# EAGLE design Wordclock-main-xtended (EAGLE 6.3)
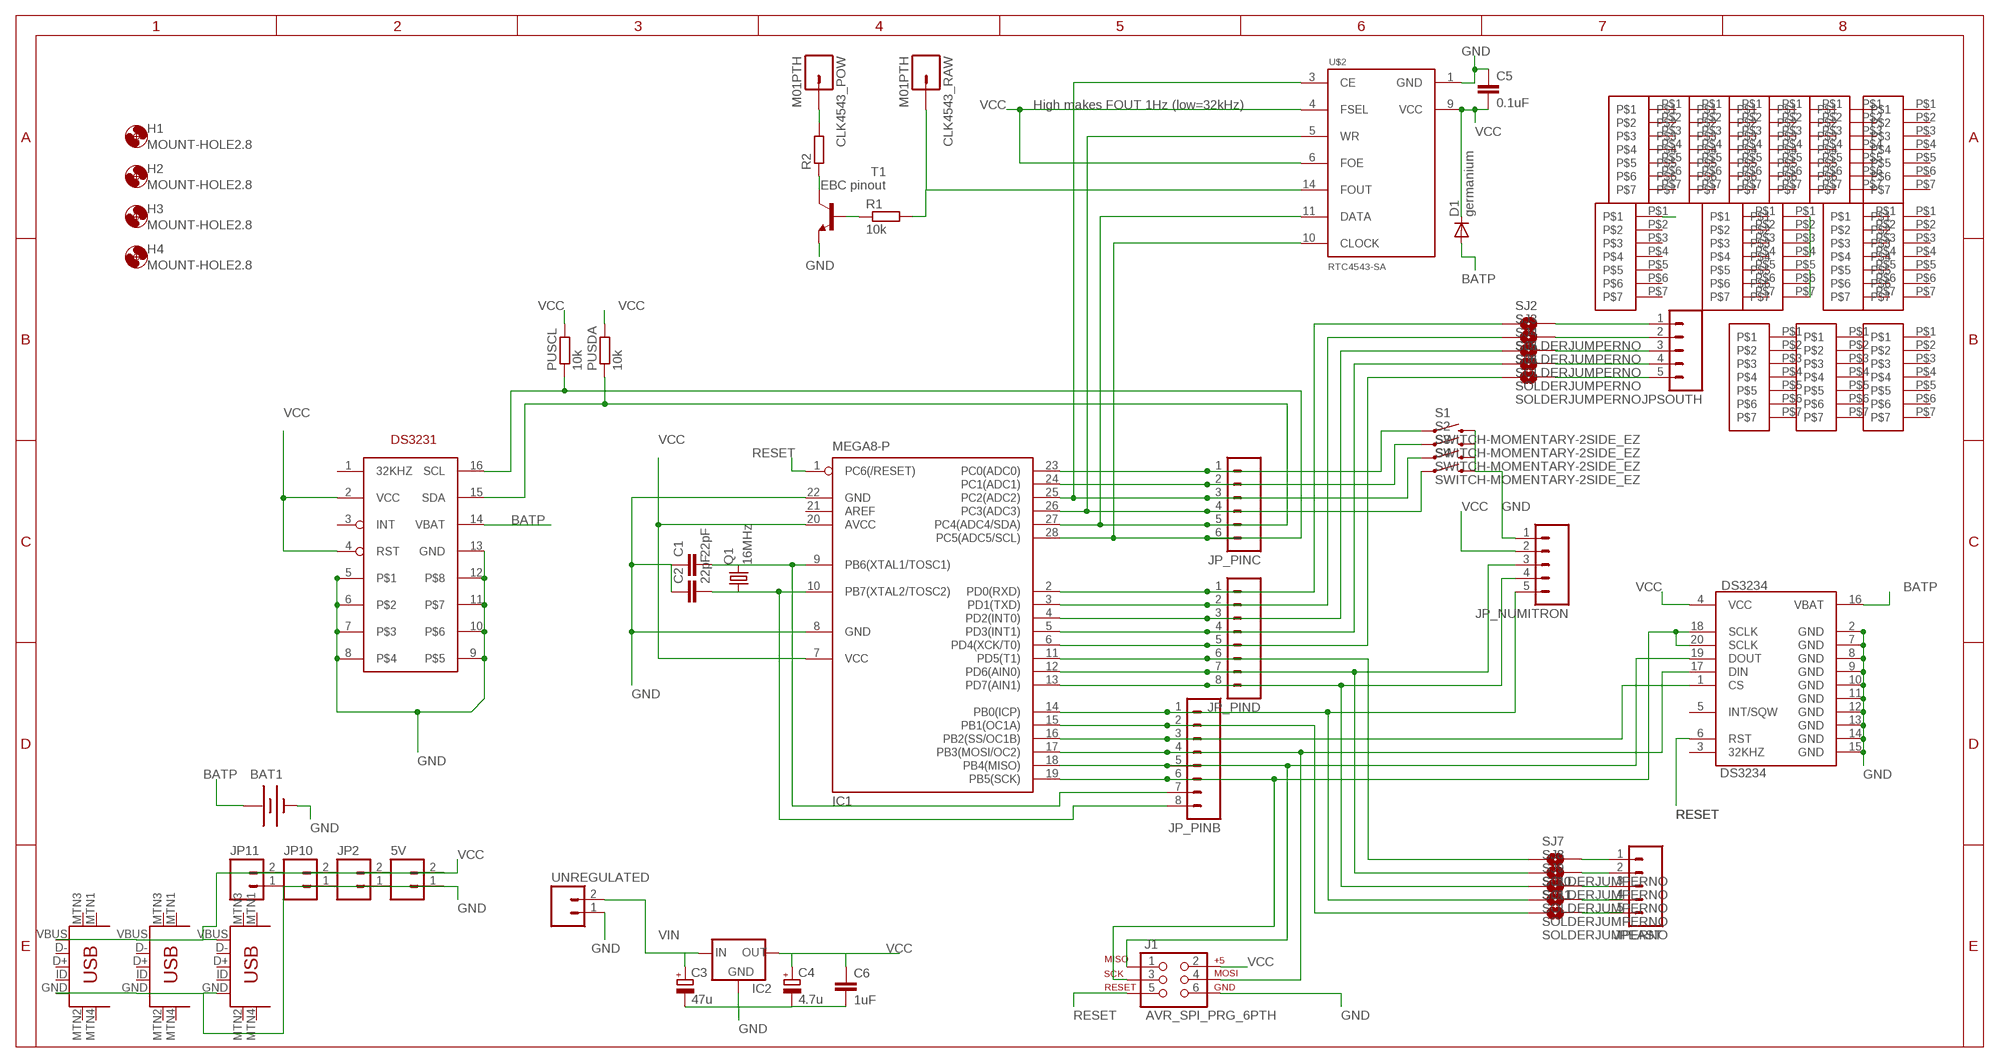
[diagram p0: schematic, sheet 1]

## Parts
5V  M02PTH  [1X02]
BAT1  BATTERY20PTH  [BATTCOM_20MM_PTH]
C1  22pF  C-EU025-024X044  [C025-024X044]
C2  22pF  C-EU025-024X044  [C025-024X044]
C3  47u  CPOL-EUE2,5-6E  [E2,5-6E]
C4  4.7u  CPOL-EUE2,5-6E  [E2,5-6E]
C5  0.1uF  C-EU025-024X044  [C025-024X044]
C6  1uF  C-EU025-024X044  [C025-024X044]
CLK4543_POW  M01PTH  [1X01]
CLK4543_RAW  M01PTH  [1X01]
D1  germanium  DIODE-D-7.5  [D-7.5]
DS3234  DS3234  [DS3234]
H1  MOUNT-HOLE2.8  [2,8]
H2  MOUNT-HOLE2.8  [2,8]
H3  MOUNT-HOLE2.8  [2,8]
H4  MOUNT-HOLE2.8  [2,8]
IC1  MEGA8-P  [DIL28-3]
IC2  V_REG_78XXSIDE  [78XXL]
J1  AVR_SPI_PRG_6PTH  [2X3]
JP1  M7_NOSILK  [M7_NOSILK]
JP2  M02PTH  [1X02]
JP3  M7_NOSILK  [M7_NOSILK]
JP4  M7_NOSILK  [M7_NOSILK]
JP5  M7_NOSILK  [M7_NOSILK]
JP6  M7_NOSILK  [M7_NOSILK]
JP7  M7_NOSILK  [M7_NOSILK]
JP8  M7_NOSILK  [M7_NOSILK]
JP9  M7_NOSILK  [M7_NOSILK]
JP10  M02PTH3  [1X02_LONGPADS]
JP11  M02PTH3  [1X02_LONGPADS]
JP_NUMITRON  M05PTH  [1X05]
JP_PINB  M081X08  [1X08]
JP_PINC  M06SIP  [1X06]
JP_PIND  M081X08  [1X08]
JPEAST  M05PTH  [1X05]
JPSOUTH  M05PTH  [1X05]
PUSCL  10k  R-EU_0204/5  [0204/5]
PUSDA  10k  R-EU_0204/5  [0204/5]
Q1  16MHz  CRYSTALHC49S  [HC49/S]
R1  10k  R-EU_0204/5  [0204/5]
R2  R-EU_0204/5  [0204/5]
S1  SWITCH-MOMENTARY-2SIDE_EZ  [TACTILE-PTH-SIDEEZ]
S2  SWITCH-MOMENTARY-2SIDE_EZ  [TACTILE-PTH-SIDEEZ]
S3  SWITCH-MOMENTARY-2SIDE_EZ  [TACTILE-PTH-SIDEEZ]
S4  SWITCH-MOMENTARY-2SIDE_EZ  [TACTILE-PTH-SIDEEZ]
SJ2  SOLDERJUMPERNO  [SJ_2S-NO]
SJ3  SOLDERJUMPERNO  [SJ_2S-NO]
SJ4  SOLDERJUMPERNO  [SJ_2S-NO]
SJ5  SOLDERJUMPERNO  [SJ_2S-NO]
SJ6  SOLDERJUMPERNO  [SJ_2S-NO]
SJ7  SOLDERJUMPERNO  [SJ_2S-NO]
SJ8  SOLDERJUMPERNO  [SJ_2S-NO]
SJ9  SOLDERJUMPERNO  [SJ_2S-NO]
SJ10  SOLDERJUMPERNO  [SJ_2S-NO]
SJ11  SOLDERJUMPERNO  [SJ_2S-NO]
T1  EBC pinout  -NPN-TO92-EBC  [TO92-EBC]
U$1  DS3231DS3231-SO16W  [SO16W]
U$2  RTC4543-SA  [SOP14]
U$3  M7_NOSILK  [M7_NOSILK]
U$4  M7_NOSILK  [M7_NOSILK]
U$5  M7_NOSILK  [M7_NOSILK]
U$6  M7_NOSILK  [M7_NOSILK]
U$7  USB-MINIB-5PIN  [USB-MINIB]
U$8  M7_NOSILK  [M7_NOSILK]
U$9  M7_NOSILK  [M7_NOSILK]
U$10  M7_NOSILK  [M7_NOSILK]
U$11  USB-MINIB-5PIN  [USB-MINIB]
U$12  USB-MINIB-5PIN  [USB-MINIB]
UNREGULATED  M02PTH3  [1X02_LONGPADS]

## Nets
BATP: BAT1.1(+) D1.A DS3234.16(VBAT) U$1.14(VBAT)
GND: 5V.1 BAT1.2(-) C1.1 C2.1 C3.- C4.- C5.1 C6.2 DS3234.2(GND) DS3234.7(GND) DS3234.8(GND) DS3234.9(GND) DS3234.10(GND) DS3234.11(GND) DS3234.12(GND) DS3234.13(GND) DS3234.14(GND) DS3234.15(GND) IC1.8(GND) IC1.22(GND) IC2.GND J1.6 JP2.1 JP10.1 JP11.1 JP_NUMITRON.1 S1.2 S2.2 S3.2 S4.2 T1.E U$1.5 U$1.6 U$1.7 U$1.8 U$1.9 U$1.10 U$1.11 U$1.12 U$1.13(GND) U$2.1(GND) U$7.GND U$8.P$1 U$8.P$2 U$8.P$3 U$8.P$4 U$11.GND U$12.GND UNREGULATED.1
N$1: IC1.23(PC0(ADC0)) JP_PINC.1 S1.1
N$2: IC1.24(PC1(ADC1)) JP_PINC.2 S2.1
N$3: JPEAST.1 SJ7.2
N$4: C1.2 IC1.9(PB6(XTAL1/TOSC1)) JP_PINB.7 Q1.2
N$5: C2.2 IC1.10(PB7(XTAL2/TOSC2)) JP_PINB.8 Q1.1
N$6: DS3234.1(CS) IC1.16(PB2(SS/OC1B)) JP_PINB.3
N$7: IC1.25(PC2(ADC2)) JP_PINC.3 S3.1 U$2.3(CE)
N$8: JPEAST.2 SJ8.2
N$9: JPEAST.3 SJ9.2
N$10: JPEAST.4 SJ10.2
N$11: JPEAST.5 SJ11.2
N$12: DS3234.18(SCLK) DS3234.20(SCLK) IC1.19(PB5(SCK)) J1.3 JP_PINB.6
N$13: DS3234.19(DOUT) IC1.18(PB4(MISO)) J1.1 JP_PINB.5
N$14: DS3234.17(DIN) IC1.17(PB3(MOSI/OC2)) J1.4 JP_PINB.4
N$15: JPSOUTH.1 SJ2.2
N$16: JPSOUTH.2 SJ3.2
N$17: JPSOUTH.3 SJ4.2
N$18: JPSOUTH.4 SJ5.2
N$19: JPSOUTH.5 SJ6.2
N$20: IC1.2(PD0(RXD)) JP_PIND.1 SJ2.1
N$21: IC1.3(PD1(TXD)) JP_PIND.2 SJ3.1
N$22: IC1.4(PD2(INT0)) JP_PIND.3 SJ4.1
N$23: IC1.5(PD3(INT1)) JP_PIND.4 SJ5.1
N$24: IC1.6(PD4(XCK/T0)) JP_PIND.5 SJ6.1
N$25: IC1.15(PB1(OC1A)) JP_PINB.2 SJ11.1
N$26: IC1.14(PB0(ICP)) JP_NUMITRON.5 JP_PINB.1 SJ10.1
N$27: IC1.13(PD7(AIN1)) JP_NUMITRON.4 JP_PIND.8 SJ9.1
N$28: IC1.12(PD6(AIN0)) JP_NUMITRON.3 JP_PIND.7 SJ8.1
N$29: IC1.11(PD5(T1)) JP_PIND.6 SJ7.1
N$30: IC1.28(PC5(ADC5/SCL)) JP_PINC.6 PUSCL.1 U$1.16(SCL) U$2.10(CLOCK)
N$31: IC1.27(PC4(ADC4/SDA)) JP_PINC.5 PUSDA.1 U$1.15(SDA) U$2.11(DATA)
N$32: IC1.26(PC3(ADC3)) JP_PINC.4 S4.1 U$2.5(WR)
N$33: CLK4543_RAW.1 R1.2 U$2.14(FOUT)
N$34: R1.1 T1.B
N$35: R2.1 T1.C
N$36: CLK4543_POW.1 R2.2
RESET: DS3234.6(RST) IC1.1(PC6(/RESET)) J1.5
VCC: 5V.2 C4.+ C5.2 C6.1 D1.C DS3234.4(VCC) IC1.7(VCC) IC1.20(AVCC) IC2.OUT J1.2 JP2.2 JP10.2 JP11.2 JP_NUMITRON.2 PUSCL.2 PUSDA.2 U$1.2(VCC) U$1.4(RST) U$2.4(FSEL) U$2.6(FOE) U$2.9(VCC) U$7.VBUS U$8.P$5 U$8.P$6 U$8.P$7 U$10.P$1 U$11.VBUS U$12.VBUS
VIN: C3.+ IC2.IN UNREGULATED.2
Unconnected: DS3234.3(32KHZ) DS3234.5(INT/SQW) IC1.21(AREF) JP1.P$1 JP1.P$2 JP1.P$3 JP1.P$4 JP1.P$5 JP1.P$6 JP1.P$7 JP3.P$1 JP3.P$2 JP3.P$3 JP3.P$4 JP3.P$5 JP3.P$6 JP3.P$7 JP4.P$1 JP4.P$2 JP4.P$3 JP4.P$4 JP4.P$5 JP4.P$6 JP4.P$7 JP5.P$1 JP5.P$2 JP5.P$3 JP5.P$4 JP5.P$5 JP5.P$6 JP5.P$7 JP6.P$1 JP6.P$2 JP6.P$3 JP6.P$4 JP6.P$5 JP6.P$6 JP6.P$7 JP7.P$1 JP7.P$2 JP7.P$3 JP7.P$4 JP7.P$5 JP7.P$6 JP7.P$7 JP8.P$1 JP8.P$2 JP8.P$3 JP8.P$4 JP8.P$5 JP8.P$6 JP8.P$7 JP9.P$1 JP9.P$2 JP9.P$3 JP9.P$4 JP9.P$5 JP9.P$6 JP9.P$7 U$1.1(32KHZ) U$1.3(INT) U$3.P$1 U$3.P$2 U$3.P$3 U$3.P$4 U$3.P$5 U$3.P$6 U$3.P$7 U$4.P$1 U$4.P$2 U$4.P$3 U$4.P$4 U$4.P$5 U$4.P$6 U$4.P$7 U$5.P$1 U$5.P$2 U$5.P$3 U$5.P$4 U$5.P$5 U$5.P$6 U$5.P$7 U$6.P$1 U$6.P$2 U$6.P$3 U$6.P$4 U$6.P$5 U$6.P$6 U$6.P$7 U$7.D+ U$7.D- U$7.ID U$7.MTN1(MTN2) U$7.MTN2(MTN3) U$7.MTN3(MTN1) U$7.MTN4 U$9.P$1 U$9.P$2 U$9.P$3 U$9.P$4 U$9.P$5 U$9.P$6 U$9.P$7 U$10.P$2 U$10.P$3 U$10.P$4 U$10.P$5 U$10.P$6 U$10.P$7 U$11.D+ U$11.D- U$11.ID U$11.MTN1(MTN2) U$11.MTN2(MTN3) U$11.MTN3(MTN1) U$11.MTN4 U$12.D+ U$12.D- U$12.ID U$12.MTN1(MTN2) U$12.MTN2(MTN3) U$12.MTN3(MTN1) U$12.MTN4

## Notes on the sheet
- High makes FOUT 1Hz (low=32kHz)

## Library data of the parts
5V JP2 JP10 JP11 = SparkFun-Connectors:M02: Header 2 Standard 2-pin 0.1" header. Use with straight break away headers (SKU : PRT-00116), right angle break away headers (PRT-00553), swiss pins (PRT-00743), machine pins (PRT-00117), and female headers (PRT-00115). Molex polarized connector foot print use with SKU : PRT-08233 with associated crimp pins and housings.
BAT1 = SparkFun:BATTERY: Battery Holders Various common sizes : AA, AAA, 20mm coin cell and 12mm coin cell.
C1 C2 C5 C6 = resistor:C-EU: CAPACITOR, European symbol
C3 C4 = resistor:CPOL-EU: POLARIZED CAPACITOR, European symbol
CLK4543_POW CLK4543_RAW = SparkFun-Connectors:M01: Header 1 Standard 1-pin 0.1" header. Use with straight break away headers (SKU : PRT-00116), right angle break away headers (PRT-00553), swiss pins (PRT-00743), machine pins (PRT-00117), and female headers (PRT-00115).
D1 = diode:DIODE-: DIODE
DS3234 = SparkFun:DS3234: DS3234 Real Time Clock
H1-H4 = holes:MOUNT-HOLE: MOUNTING HOLE with drill center marker
IC1 = atmel:MEGA8-P: MICROCONTROLLER 8 Kbytes FLASH, 1 kbytes SRAM, 512 bytes EEPROM, USART, 4-channel 10 bit ADC, 2-channel 8 bit ADC Pin compatible with Atmega48, ATMega88, ATMega168 Source: avr.lbr; OC_FARNELL: unknown; OC_NEWARK: unknown
IC2 = SparkFun:V_REG_78XX: Voltage Regulator Standard 7805 5V regulator. IGO (Input Ground Output). Spark Fun Electronics SKU : COM-00107
J1 = SparkFun:AVR_SPI_PRG_6: AVR ISP 6 Pin This is the reduced ISP connector for AVR programming. Common on Arduino. This footprint will take up less PCB space and can be used with a 10-pin to 6-pin adapter such as SKU: BOB-08508
JP1 JP3-JP9 U$3-U$6 U$8-U$10 = kalshagar:M7_NOSILK
JP_NUMITRON = SparkFun-Connectors:M05: Header 5 Standard 5-pin 0.1" header. Use with straight break away headers (SKU : PRT-00116), right angle break away headers (PRT-00553), swiss pins (PRT-00743), machine pins (PRT-00117), and female headers (PRT-00115). Molex polarized connector foot print use with SKU : PRT-08230 with associated crimp pins and housings.
JP_PINB JP_PIND = SparkFun-Connectors:M08: Header 8 Standard 8-pin 0.1" header. Use with straight break away headers (SKU : PRT-00116), right angle break away headers (PRT-00553), swiss pins (PRT-00743), machine pins (PRT-00117), and female headers (PRT-00115).
JP_PINC = SparkFun-Connectors:M06: Header 6 Standard 6-pin 0.1" header. Use with straight break away headers (SKU : PRT-00116), right angle break away headers (PRT-00553), swiss pins (PRT-00743), machine pins (PRT-00117), and female headers (PRT-00115). Molex polarized connector foot print use with SKU : PRT-08094 with associated crimp pins and housings. NOTES ON THE VARIANTS LOCK and LOCK_LONGPADS... This footprint was designed to help hold the alignment of a through-hole component (i.e. 6-pin header) while soldering it into place. You may notice that each hole has been shifted either up or down by 0.005 of an inch from it's more standard position (which is a perfectly straight line). This slight alteration caused the pins (the squares in the middle) to touch the edges of the holes. Because they are alternating, it causes a "brace" to hold the component in place. 0.005 has proven to be the perfect amount of "off-center" position when using our standard breakaway headers. Although looks a little odd when you look at the bare footprint, once you have a header in there, the alteration is very hard to notice. Also, if you push a header all the way into place, it is covered up entirely on the bottom side. This idea of altering the position of holes to aid alignment will be further integrated into the Sparkfun Library for other footprints. It can help hold any component with 3 or more connection pins.
JPEAST JPSOUTH = SparkFun:M05: Header 5 Standard 5-pin 0.1" header. Use with straight break away headers (SKU : PRT-00116), right angle break away headers (PRT-00553), swiss pins (PRT-00743), machine pins (PRT-00117), and female headers (PRT-00115). Molex polarized connector foot print use with SKU : PRT-08230 with associated crimp pins and housings.
PUSCL PUSDA R1 R2 = resistor:R-EU_: RESISTOR, European symbol
Q1 = crystal:CRYSTAL: CRYSTAL; OC_FARNELL: 1667008; OC_NEWARK: unknown
S1-S4 = SparkFun-Electromechanical:SWITCH-MOMENTARY-2: Various NO switches- pushbuttons, reed, etc
SJ2-SJ11 = SparkFun:SOLDERJUMPER: Solder Jumper Standard SMD solder jumper. Used to automate production. Two varients : Normally Open and Normally Closed are the same, but have different paste layers. NC will have a large amount of paste and should jumper during reflow.
T1 = transistor:*-NPN-: NPN Transistror BF959 corrected 2008.03.06
U$1 = kalshagar:DS3231: DS3231 with a WIDE package SO16W. About 1cm x 1cm.
U$2 = kalshagar:RTC4543-SA
U$7 U$11 U$12 = SparkFun-Connectors:USB-MINIB: Mini-USB "B" connector with 5th pin broken out. Created new symbol breaking out 5th "ID" pin in mini/micro USB connector spec. See: http://en.wikipedia.org/wiki/Mini_usb#Cables. Uses same footprint as 4-pin symbol. Also added pins to connect to mounting / shield pads if required (probably not generally needed as signals aren't shielded once they leave the connector).
UNREGULATED = SparkFun:M02: Header 2 Standard 2-pin 0.1" header. Use with straight break away headers (SKU : PRT-00116), right angle break away headers (PRT-00553), swiss pins (PRT-00743), machine pins (PRT-00117), and female headers (PRT-00115). Molex polarized connector foot print use with SKU : PRT-08233 with associated crimp pins and housings.

## Board
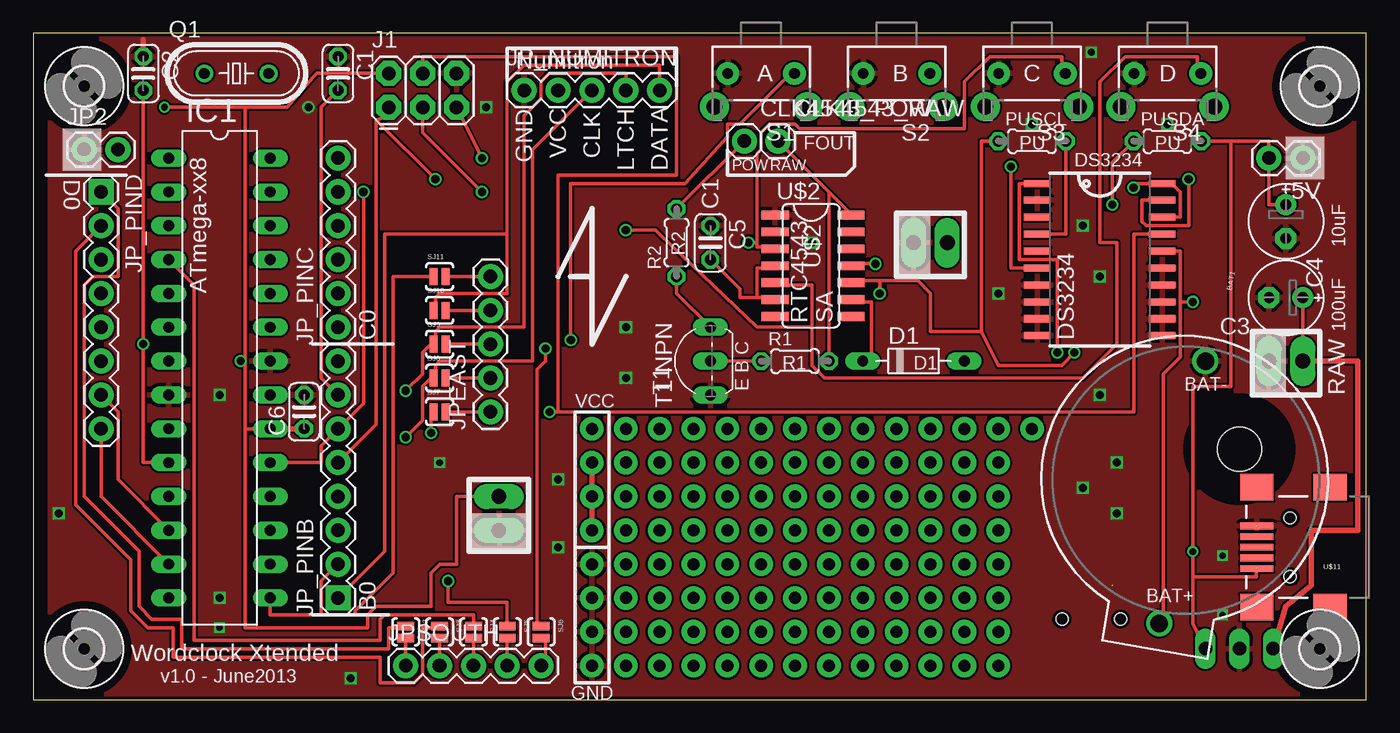
[diagram p1: board, top side]
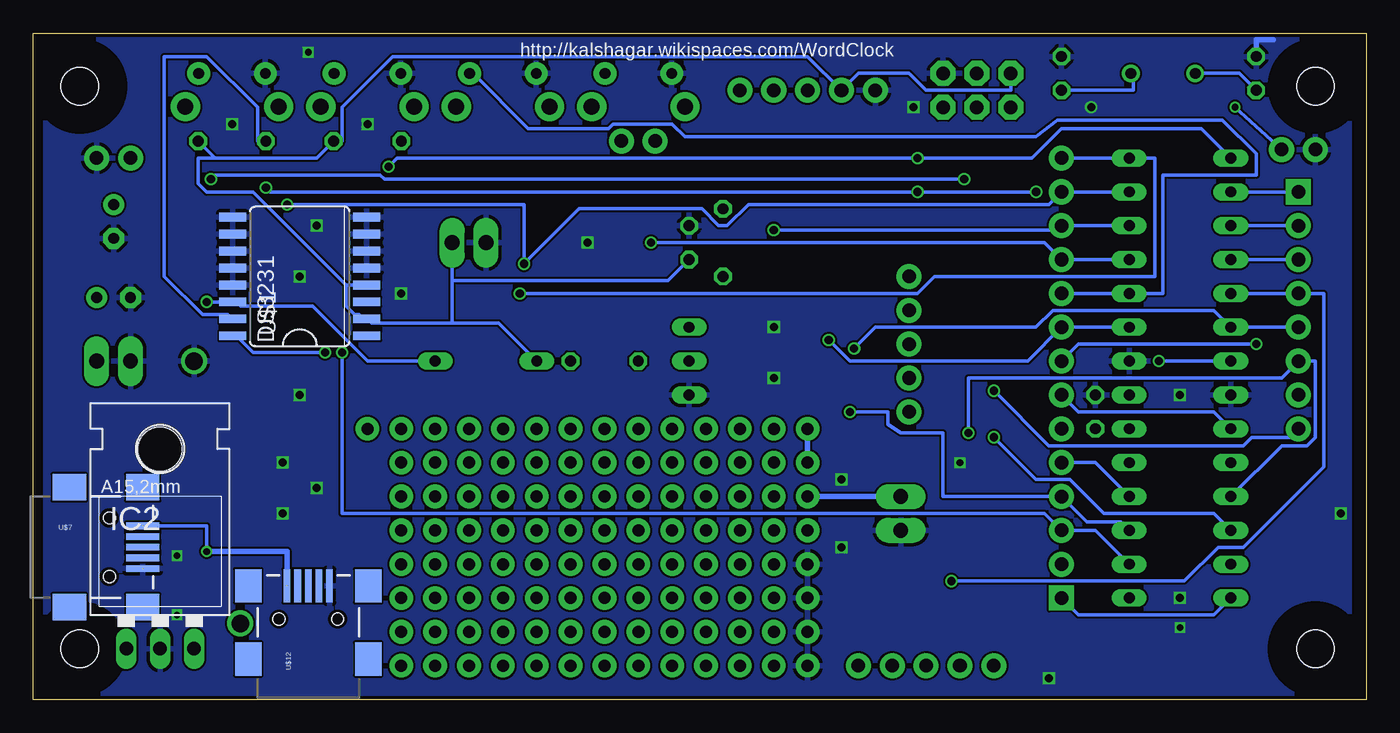
[diagram p2: board, bottom side, seen from below]

Size 100 x 50 mm. Coordinates in mm from the lower left corner, seen from the top.
Outline: 0,0 100,0 100,50 0,50 0,0
Copper layers (1*16): Top 0.035mm / dielectric 1.5mm / Bottom 0.035mm
Design rules "Fusion_eagle_rule_v1.1": minimum track width 6mil, minimum drill 12mil, track to track 6mil, track to pad 6mil, pad to pad 6mil, via to via 6mil, smd to smd 0mil, copper to edge 10mil, drill to drill 10mil, minimum pad ring 10mil, minimum via ring 6mil, stop-mask expansion 2mil, vias tented up to drill 100mil, thermal gap 10mil
tKeepout: area 0,0 to 2.5,50; area 97.5,0 to 100,50

### Footprints (pad centres in the part's own frame; a part is rotated, then mirrored left to right if it is on the bottom)
1X02 = drill 1.016 pad 1.88: 1 0,0; 2 2.54,0
BATTCOM_20MM_PTH = drill 1.3: 1 20,0; 2 0,0
C025-024X044 = drill 0.813 octagon: 1 -1.27,0; 2 1.27,0
E2,5-6E = drill 0.813 pad 1.575: + -1.27,0 | drill 0.813 pad 1.575 octagon: - 1.27,0
1X01 = drill 1.016 pad 1.88: 1 0,0
D-7.5 = drill 0.813 long: A 3.81,0; C -3.81,0
DS3234 = smd 0.53 x 1.98: 1 -5.715,-4.685; 2 -4.445,-4.685; 3 -3.175,-4.685; 4 -1.905,-4.685; 5 -0.635,-4.685; 6 0.635,-4.685; 7 1.905,-4.685; 8 3.175,-4.685; 9 4.445,-4.685; 10 5.715,-4.685; 11 5.715,4.685; 12 4.445,4.685; 13 3.175,4.685; 14 1.905,4.685; 15 0.635,4.685; 16 -0.635,4.685; 17 -1.905,4.685; 18 -3.175,4.685; 19 -4.445,4.685; 20 -5.715,4.685
2,8 = hole 2.8: 0,0
DIL28-3 = drill 0.813 long: 1 -16.51,-3.81; 2 -13.97,-3.81; 3 -11.43,-3.81; 4 -8.89,-3.81; 5 -6.35,-3.81; 6 -3.81,-3.81; 7 -1.27,-3.81; 8 1.27,-3.81; 9 3.81,-3.81; 10 6.35,-3.81; 11 8.89,-3.81; 12 11.43,-3.81; 13 13.97,-3.81; 14 16.51,-3.81; 15 16.51,3.81; 16 13.97,3.81; 17 11.43,3.81; 18 8.89,3.81; 19 6.35,3.81; 20 3.81,3.81; 21 1.27,3.81; 22 -1.27,3.81; 23 -3.81,3.81; 24 -6.35,3.81; 25 -8.89,3.81; 26 -11.43,3.81; 27 -13.97,3.81; 28 -16.51,3.81
78XXL = drill 1.016 long: GND 0,-3.81; IN -2.54,-3.81; OUT 2.54,-3.81 | hole 3.302: 0,11.176
2X3 = drill 1.016 pad 1.88 octagon: 1 0,0; 2 0,2.54; 3 2.54,0; 4 2.54,2.54; 5 5.08,0; 6 5.08,2.54
M7_NOSILK = drill 0.9 pad 1.778: P$1 0,0; P$2 2.54,0; P$3 5.08,0; P$4 7.62,0; P$5 10.16,0; P$6 12.7,0; P$7 15.24,0
1X02_LONGPADS = drill 1.118 pad 1.88 long: 1 0,0; 2 2.54,0
1X05 = drill 1.016 pad 1.88: 1 0,0; 2 2.54,0; 3 5.08,0; 4 7.62,0; 5 10.16,0
1X08 = drill 1.016 pad 1.88 square: 1 0,0 | drill 1.016 pad 1.88: 2 2.54,0; 3 5.08,0; 4 7.62,0; 5 10.16,0; 6 12.7,0; 7 15.24,0; 8 17.78,0
1X06 = drill 1.016 pad 1.88: 1 0,0; 2 2.54,0; 3 5.08,0; 4 7.62,0; 5 10.16,0; 6 12.7,0
0204/5 = drill 0.813 octagon: 1 -2.54,0; 2 2.54,0
HC49/S = drill 0.813: 1 -2.413,0; 2 2.413,0
TACTILE-PTH-SIDEEZ = drill 0.8 pad 1.7: 1 -2.5,0; 2 2.5,0 | drill 1.2 pad 2.2: ANCHOR1 -3.5,2.5; ANCHOR2 3.5,2.5
SJ_2S-NO = smd 0.635 x 1.27: 1 -0.45,0; 2 0.45,0
TO92-EBC = drill 0.813 long: B 0,-1.27; C 2.54,-1.27; E -2.54,-1.27
SO16W = smd 0.66 x 2.032: 1 -5.715,-5.029; 2 -4.445,-5.029; 3 -3.175,-5.029; 4 -1.905,-5.029; 5 -0.635,-5.029; 6 0.635,-5.029; 7 1.905,-5.029; 8 3.175,-5.029; 9 3.175,5.029; 10 1.905,5.029; 11 0.635,5.029; 12 -0.635,5.029; 13 -1.905,5.029; 14 -3.175,5.029; 15 -4.445,5.029; 16 -5.715,5.029
SOP14 = smd 0.66 x 2.032: 1 -3.345,-2.76; 2 -2.075,-2.76; 3 -0.805,-2.76; 4 0.465,-2.76; 5 1.735,-2.76; 6 3.005,-2.76; 7 4.275,-2.76; 8 4.275,2.917; 9 3.005,2.917; 10 1.735,2.917; 11 0.465,2.917; 12 -0.805,2.917; 13 -2.075,2.917; 14 -3.345,2.917
USB-MINIB = smd 2.5 x 0.5: D+ 2.5,0; D- 2.5,0.8; GND 2.5,-1.6; ID 2.5,-0.8; VBUS 2.5,1.6 | smd 2.5 x 2: MTN1 -3,4.5; MTN2 2.5,4.5; MTN3 -3,-4.5; MTN4 2.5,-4.5 | hole 0.9: 0,2.2; 0,-2.2

### Placement (x,y rotation side)
5V  95.25,40.64 180 top
BAT1  87.95,25.4 260 top
C1  22.86,46.99 270 top
C2  8.26,46.99 270 top
C3  93.98,30.16 180 top
C4  93.98,35.88 270 top
C5  50.8,34.29 270 top
C6  20.32,21.59 90 top
CLK4543_POW  53.34,41.91 0 top
CLK4543_RAW  55.88,41.91 0 top
D1  66.04,25.4 0 top
DS3234  80.01,33.02 270 top
H1  3.81,3.81 0 top
H2  96.52,46.04 0 top
H3  96.52,3.81 0 top
H4  3.81,46.04 0 top
IC1  13.97,24.13 270 top
IC2  90.49,7.62 0 bottom
J1  26.67,44.45 0 top
JP1  69.85,2.54 90 top
JP2  3.81,41.27 0 top
JP3  67.31,2.54 90 top
JP4  64.77,2.54 90 top
JP5  62.23,2.54 90 top
JP6  59.69,2.54 90 top
JP7  57.15,2.54 90 top
JP8  54.61,2.54 90 top
JP9  52.07,2.54 90 top
JP10  66.04,34.29 0 top
JP11  34.92,12.7 90 top
JP_NUMITRON  36.83,45.72 0 top
JP_PINB  22.86,7.62 90 top
JP_PINC  22.86,27.94 90 top
JP_PIND  5.08,38.1 270 top
JPEAST  34.29,21.59 90 top
JPSOUTH  27.94,2.54 0 top
PUSCL  74.93,41.91 0 top
PUSDA  85.09,41.91 0 top
Q1  15.24,46.99 0 top
R1  57.15,25.4 0 top
R2  48.26,34.29 90 top
S1  54.61,46.99 180 top
S2  64.77,46.99 180 top
S3  74.93,46.99 180 top
S4  85.09,46.99 180 top
SJ2  27.94,5.08 270 top
SJ3  30.48,5.08 270 top
SJ4  33.02,5.08 270 top
SJ5  35.56,5.08 270 top
SJ6  38.1,5.08 270 top
SJ7  30.48,21.59 0 top
SJ8  30.48,24.13 0 top
SJ9  30.48,26.67 0 top
SJ10  30.48,29.21 0 top
SJ11  30.48,31.75 0 top
T1  49.53,25.4 90 top
U$1  80.01,33.02 90 bottom
U$2  58.42,33.02 270 top
U$3  49.53,2.54 90 top
U$4  72.39,2.54 90 top
U$5  46.99,2.54 90 top
U$6  44.45,2.54 90 top
U$7  94.3,11.43 0 bottom
U$8  41.91,2.54 90 top
U$9  59.69,20.32 0 top
U$10  41.91,20.32 0 top
U$11  94.3,11.43 180 top
U$12  79.38,6.03 90 bottom
UNREGULATED  92.71,25.4 0 top

### Tracks (layer width: path | path; a pad name or v marks a point on that pad's centre or on a via)
BATP  (via drill 0.61)
  Top 0.254: DS3234.16 86.04,33.66 86.04,29.84 | 86.04,29.84 86.04,25.72 84.77,24.45 84.77,6.03 BAT1.1 | 86.04,29.84 v87,29.84
  Bottom 0.254: D1.A 74.93,25.4 79.06,29.53 84.45,29.53 84.77,29.84 U$1.14 v87,29.84
GND  (via drill 0.5, 0.6)
  Top 0.406: C2.1 8.26,49.53
  Bottom 0.406: 6.99,49.53 8.26,49.53 C2.1
  other vias: 58.42,34.29 44.45,27.94 44.45,24.13 80.01,22.86 80.01,31.75 78.74,35.56 81.28,17.78 81.28,13.97 78.74,15.88 74.93,43.18 13.97,22.86 39.37,16.51 39.37,11.43 72.39,30.48 13.97,7.62 1.91,13.97 23.81,1.59 20.64,44.45 85.09,43.18 33.97,44.45 13.97,5.4 30.48,17.78 89.22,10.79 89.22,6.35 79.38,48.58
  pour Bottom: 1.27,52.07 99.06,52.07 99.06,-1.27 1.27,-1.27
  pour Top: 1.27,53.34 99.06,53.34 99.06,-2.54 1.27,-2.54
N$1  (via drill 0.61)
  Top 0.254: v40.32,26.99 40.32,38.73 48.9,38.73 52.07,42.23 52.07,43.18 53.02,43.18 56.83,46.99 S1.1
  Bottom 0.254: IC1.23 JP_PINC.1 25.4,25.4 38.73,25.4 v40.32,26.99
N$2
  Bottom 0.254: JP_PINC.2 IC1.24 15.24,30.48 15.24,39.37 8.26,39.37 8.26,40.96 10.79,43.5 23.18,43.5 24.77,42.23 51.12,42.23 52.07,43.18 56.52,43.18 56.83,42.86 62.87,42.86 66.99,46.99 S2.1
N$3
  Top 0.254: JPEAST.1 SJ7.2
N$4
  Top 0.254: C1.2 21.59,44.45 21.59,24.13 JP_PINB.7
  Bottom 0.254: C1.2 17.46,45.72 17.46,46.99 Q1.2 | IC1.9 11.43,21.59 21.59,21.59 JP_PINB.7
N$5  (via drill 0.61)
  Top 0.254: IC1.10 8.26,17.78 v8.26,26.67 C2.2
  Bottom 0.254: C2.2 9.53,46.99 Q1.1 | JP_PINB.8 21.59,26.67 v8.26,26.67
N$6  (via drill 0.61)
  Top 0.254: DS3234.1 73.98,38.73 73.98,33.02 76.83,33.02 v76.83,26.04
  Bottom 0.254: v76.83,26.04 76.83,13.97 24.13,13.97 JP_PINB.3 20.32,12.7 IC1.16
N$7  (via drill 0.61)
  Top 0.254: 54.29,34.29 54.29,40.96 54.61,41.27 54.61,42.55 55.24,43.18 57.15,43.18 57.47,42.86 69.85,42.86 69.85,46.35 71.75,48.26 77.15,48.26 77.15,46.99 S3.1 | 54.29,34.29 54.29,33.97 55.56,33.97 U$2.3 | 54.29,34.29 v53.66,34.29
  Bottom 0.254: IC1.25 JP_PINC.3 24.13,34.29 v53.66,34.29
N$8
  Top 0.254: JPEAST.2 SJ8.2
N$9
  Top 0.254: JPEAST.3 SJ9.2
N$10
  Top 0.254: JPEAST.4 SJ10.2
N$11
  Top 0.254: JPEAST.5 SJ11.2
N$12  (via drill 0.61)
  Top 0.254: IC1.19 21.59,17.78 21.59,19.05 JP_PINB.6 24.77,22.23 v24.77,38.1 | DS3234.18 86.04,36.2 86.04,38.1 85.41,38.73 DS3234.20 82.55,38.73 v82.55,38.42 | v33.66,38.1 29.21,42.55 J1.3
  Bottom 0.254: v82.55,38.42 82.23,38.1 v33.66,38.1 v24.77,38.1
N$13  (via drill 0.61)
  Top 0.254: DS3234.19 83.19,37.47 83.19,35.88 83.5,35.56 86.68,35.56 v86.68,39.05 | 25.72,43.5 26.67,43.81 J1.1 | 25.72,43.5 v30.16,39.05 | JP_PINB.5 25.72,20.64 25.72,43.5
  Bottom 0.254: IC1.18 20.32,17.78 JP_PINB.5 | v86.68,39.05 86.36,39.37 73.98,39.37 73.66,39.05 v30.16,39.05
N$14  (via drill 0.61)
  Top 0.254: DS3234.17 82.55,34.92 82.55,21.59 39.37,21.59 | v38.73,21.59 39.37,21.59 | J1.4 29.21,48.26 48.26,48.26 48.26,39.37 39.37,39.37 39.37,21.59
  Bottom 0.254: v38.73,21.59 35.88,21.59 35.88,20.64 34.92,20 31.75,20 31.75,15.24 JP_PINB.4 20.95,13.34 18.41,13.34 IC1.17
N$15
  Top 0.254: JPSOUTH.1 SJ2.2
N$16
  Top 0.254: JPSOUTH.2 SJ3.2
N$17
  Top 0.254: JPSOUTH.3 SJ4.2
N$18
  Top 0.254: JPSOUTH.4 SJ5.2
N$19
  Top 0.254: JPSOUTH.5 38.42,2.86 38.42,4.45 SJ6.2
N$20
  Top 0.254: JP_PIND.1 6.35,36.83 6.35,31.75 4.45,31.75 3.81,31.11 3.81,15.24 7.94,11.11 7.94,6.99 8.89,6.03 11.11,6.03 11.11,3.81 26.67,3.81 26.67,5.4 27.94,5.4 SJ2.1
  Bottom 0.254: JP_PIND.1 IC1.2
N$21
  Top 0.254: JP_PIND.2 3.17,33.66 3.17,14.61 7.3,10.48 7.3,6.67 8.57,5.4 10.48,5.4 10.48,3.17 26.04,3.17 26.04,1.27 28.57,1.27 29.21,1.91 29.21,5.4 30.48,5.4 SJ3.1
  Bottom 0.254: JP_PIND.2 IC1.3
N$22
  Top 0.254: SJ4.1 33.02,6.35 26.35,6.35 26.04,6.03 26.04,4.45 12.06,4.45 12.06,31.11 IC1.4
  Bottom 0.254: IC1.4 JP_PIND.3
N$23  (via drill 0.61)
  Top 0.254: v31.11,8.89 31.11,7.3 35.56,7.3 SJ5.1
  Bottom 0.254: v31.11,8.89 13.65,8.89 11.11,11.43 9.21,11.43 3.17,17.46 3.17,30.48 JP_PIND.4 IC1.5
N$24  (via drill 0.61)
  Top 0.254: v38.42,26.35 38.42,25.4 37.78,24.77 37.78,5.71 SJ6.1
  Bottom 0.254: v38.42,26.35 36.83,27.94 24.77,27.94 23.5,29.21 11.43,29.21 IC1.6 JP_PIND.5
N$25
  Top 0.254: SJ11.1 26.99,31.75 26.99,9.53 24.13,6.67 24.13,6.35 21.59,6.35 | 21.59,6.35 17.78,6.35 IC1.15 | JP_PINB.2 21.59,8.89 21.59,6.35
N$26
  Top 0.254: 35.56,34.92 35.56,46.35 36.83,47.62 46.99,47.62 JP_NUMITRON.5 | 35.56,34.92 35.56,30.48 30.48,30.48 30.16,30.16 30.16,29.21 SJ10.1 | JP_PINB.1 26.35,11.11 26.35,34.92 35.56,34.92
  Bottom 0.254: IC1.14 11.43,6.35 21.59,6.35 JP_PINB.1
N$27  (via drill 0.61)
  Top 0.254: IC1.13 5.08,15.24 JP_PIND.8 | JP_NUMITRON.4 44.45,46.99 38.73,46.99 38.1,46.35 38.1,45.09 36.83,43.81 36.83,27.94 30.48,27.94 30.16,27.62 30.16,26.67 SJ9.1 29.84,26.67 29.21,26.04 29.21,24.45 v27.94,23.18
  Bottom 0.254: JP_PIND.8 5.71,19.68 8.57,19.68 9.21,19.05 23.81,19.05 v27.94,23.18
N$28  (via drill 0.61)
  Top 0.254: IC1.12 6.35,16.51 6.35,21.59 JP_PIND.7 | JP_NUMITRON.3 37.47,41.27 37.47,25.4 30.48,25.4 30.16,25.08 30.16,24.13 SJ8.1 29.84,24.13 29.21,23.5 29.21,20.95 v27.94,19.68
  Bottom 0.254: IC1.12 11.43,13.97 19.68,13.97 22.23,16.51 24.77,16.51 v27.94,19.68
N$29  (via drill 0.61)
  Top 0.254: v29.84,20 29.84,21.59 SJ7.1
  Bottom 0.254: v29.84,20 29.84,24.13 6.35,24.13 JP_PIND.6 3.81,25.4 3.81,19.68 4.45,19.05 6.35,19.05 IC1.11
N$30  (via drill 0.61)
  Top 0.254: 71.12,27.62 67.31,27.62 67.31,30.48 66.36,31.43 63.5,31.43 | 63.5,31.43 61.59,31.43 U$2.10 | PUSCL.1 71.12,41.91 71.12,27.62 | v78.11,26.04 77.15,25.08 72.39,25.08 71.12,27.62 | 63.5,31.43 v63.5,30.48
  Bottom 0.254: JP_PINC.6 IC1.28 15.88,40.64 15.88,31.75 32.38,31.75 33.66,30.48 v63.5,30.48 | v78.11,26.04 83.5,26.04 84.77,27.3 U$1.16
N$31  (via drill 0.61)
  Top 0.254: v63.18,32.7 61.59,32.7 U$2.11 | PUSDA.1 80.96,40.32 v80.96,37.15
  Bottom 0.254: PUSDA.1 83.19,41.91 83.19,44.45 87,48.26 90.17,48.26 90.17,31.75 87.31,28.89 85.41,28.89 85.09,28.57 U$1.15 | IC1.27 JP_PINC.5 23.81,37.15 46.35,37.15 47.94,35.56 48.58,35.56 49.85,36.83 59.05,36.83 v63.18,32.7 63.18,37.15 v80.96,37.15
N$32  (via drill 0.61)
  Top 0.254: 58.42,27.94 58.42,25.08 59.37,24.13 78.74,24.13 81.28,26.67 81.28,34.29 80.01,34.29 80.01,46.35 81.92,48.26 87.31,48.26 87.31,46.99 S4.1 | 58.42,27.94 58.42,31.11 55.88,31.11 U$2.5 | v44.45,35.24 46.67,35.24 46.99,34.92 54.29,27.94 58.42,27.94
  Bottom 0.254: IC1.26 JP_PINC.4 23.18,35.24 v44.45,35.24
N$33
  Top 0.254: CLK4543_RAW.1 59.69,38.1 | 59.69,38.1 61.28,36.51 U$2.14 | 59.69,38.1 R1.2
N$34
  Top 0.254: R1.1 T1.B
N$35
  Top 0.254: T1.C 48.26,30.48 R2.1
N$36
  Top 0.254: CLK4543_POW.1 R2.2
RESET  (via drill 0.61)
  Top 0.254: DS3234.6 73.34,32.38 v73.34,40.01 | v33.66,40.64 J1.5
  Bottom 0.254: v73.34,40.01 72.71,40.64 v33.66,40.64 25.08,40.64 22.86,42.86 12.38,42.86 IC1.1
VCC  (via drill 0.5, 0.61)  (3 unrouted)
  Top 0.254: 15.88,20.32 IC1.20 | 15.88,44.45 19.05,44.45 21.27,46.99 J1.2 | 15.88,44.45 15.88,25.4 | 15.88,25.4 15.88,20.32 | 15.88,25.4 v15.56,25.4 | 54.29,30.16 53.02,30.16 53.02,30.8 C5.2 | 54.29,30.16 55.56,30.16 U$2.6 | 54.29,30.16 54.29,32.38 55.56,32.38 U$2.4 | D1.C 62.87,26.04 62.87,29.84 61.59,29.84 U$2.9 | DS3234.4 77.47,34.92 PUSCL.2 | C4.+ 92.71,37.15 5V.2 92.71,41.91 89.85,41.91 | IC2.OUT 87,5.71 87,9.21 | 87,9.21 v87,11.11 87,23.5 89.85,23.5 89.85,41.91 | 89.85,41.91 PUSDA.2 | 15.88,44.45 v9.84,44.45 | 15.88,20.32 15.88,5.4 25.08,5.4 25.08,6.35 25.72,6.99 29.84,6.99 29.84,9.53 30.48,10.16 31.75,10.16 31.75,15.24 JP11.2 | 87,9.21 91.76,9.21 91.76,9.84
  Top 0.406: IC1.20 C6.1 | U$8.P$5 U$8.P$6 U$8.P$7
  Bottom 0.254: v15.56,25.4 IC1.7 | J1.2 26.67,45.72 33.02,45.72 34.29,46.99 38.1,46.99 JP_NUMITRON.2 41.91,48.26 73.03,48.26 76.83,44.45 76.83,41.91 PUSCL.2 78.74,40.64 86.36,40.64 | 76.52,31.11 76.52,29.53 75.88,28.89 75.56,28.89 75.25,28.57 U$1.2 74.93,28.57 74.61,28.26 68.58,28.26 | U$1.4 76.52,31.11 | 68.58,28.26 65.09,28.26 D1.C | C5.2 52.39,31.43 68.58,31.43 | 68.58,28.26 68.58,31.43 | PUSDA.2 86.36,40.64 | 76.52,31.11 83.5,38.1 87,38.1 87.63,38.73 87.63,40.64 86.36,40.64 | 68.58,31.43 JP10.2 | v9.84,44.45 JP2.2 | 91.76,13.02 87,13.02 v87,11.11
  Bottom 0.406: 80.96,8.57 80.96,11.11 v87,11.11 | JP11.2 U$8.P$6 | U$8.P$7 U$10.P$1
VIN
  Top 0.254: UNREGULATED.2 C3.+
  Top 0.406: IC2.IN 93.98,6.99 95.89,8.57 95.89,12.7 99.38,12.7 99.38,25.4 UNREGULATED.2

### Text on the board
tPlace: Numitron | A | B | C | D | VCC | CLK | FOUT | PU | PU | GND | LTCH | DATA | POW | RAW | D0 | C1 | 10uF | R2 | ATmega-xx8 | RTC4543 | SA | 100uF | C0 | DS3234 | R1 | D1 | E B C | BAT- | RAW | VCC | T1 NPN | B0 | BAT+ | Wordclock Xtended | v1.0 - June2013 | GND
bPlace: http://kalshagar.wikispaces.com/WordClock | DS3231